# EAGLE schematic pwm (EAGLE 6.0)
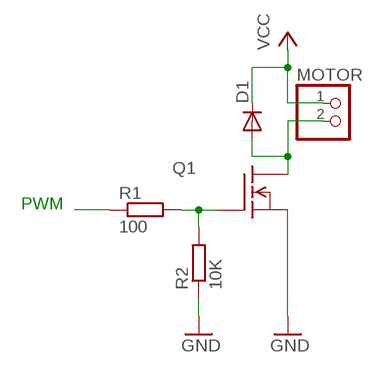
[diagram p0: schematic, sheet 1]

## Parts
D1  1N4933  [DO41-10]
MOTOR  PINHD-1X2  [1X02]
Q1  BUZ60  [TO220]
R1  100  R-EU_0207/10  [0207/10]
R2  10K  R-EU_0207/10  [0207/10]

## Nets
GND: Q1.3(S) R2.1
N$1: Q1.1(G) R1.2 R2.2
N$2: D1.A MOTOR.2 Q1.2(D)
N$3: R1.1
VCC: D1.C MOTOR.1

## Notes on the sheet
- PWM

## Library data of the parts
D1 = diode:1N4933: DIODE fast recovery rectifier, 1A
MOTOR = pinhead:PINHD-1X2: PIN HEADER
Q1 = transistor-fet:BUZ60: N-Channel Enhancement MOSFET 400V; 5,5A; 1,0Ohm
R1 R2 = resistor:R-EU_: RESISTOR, European symbol